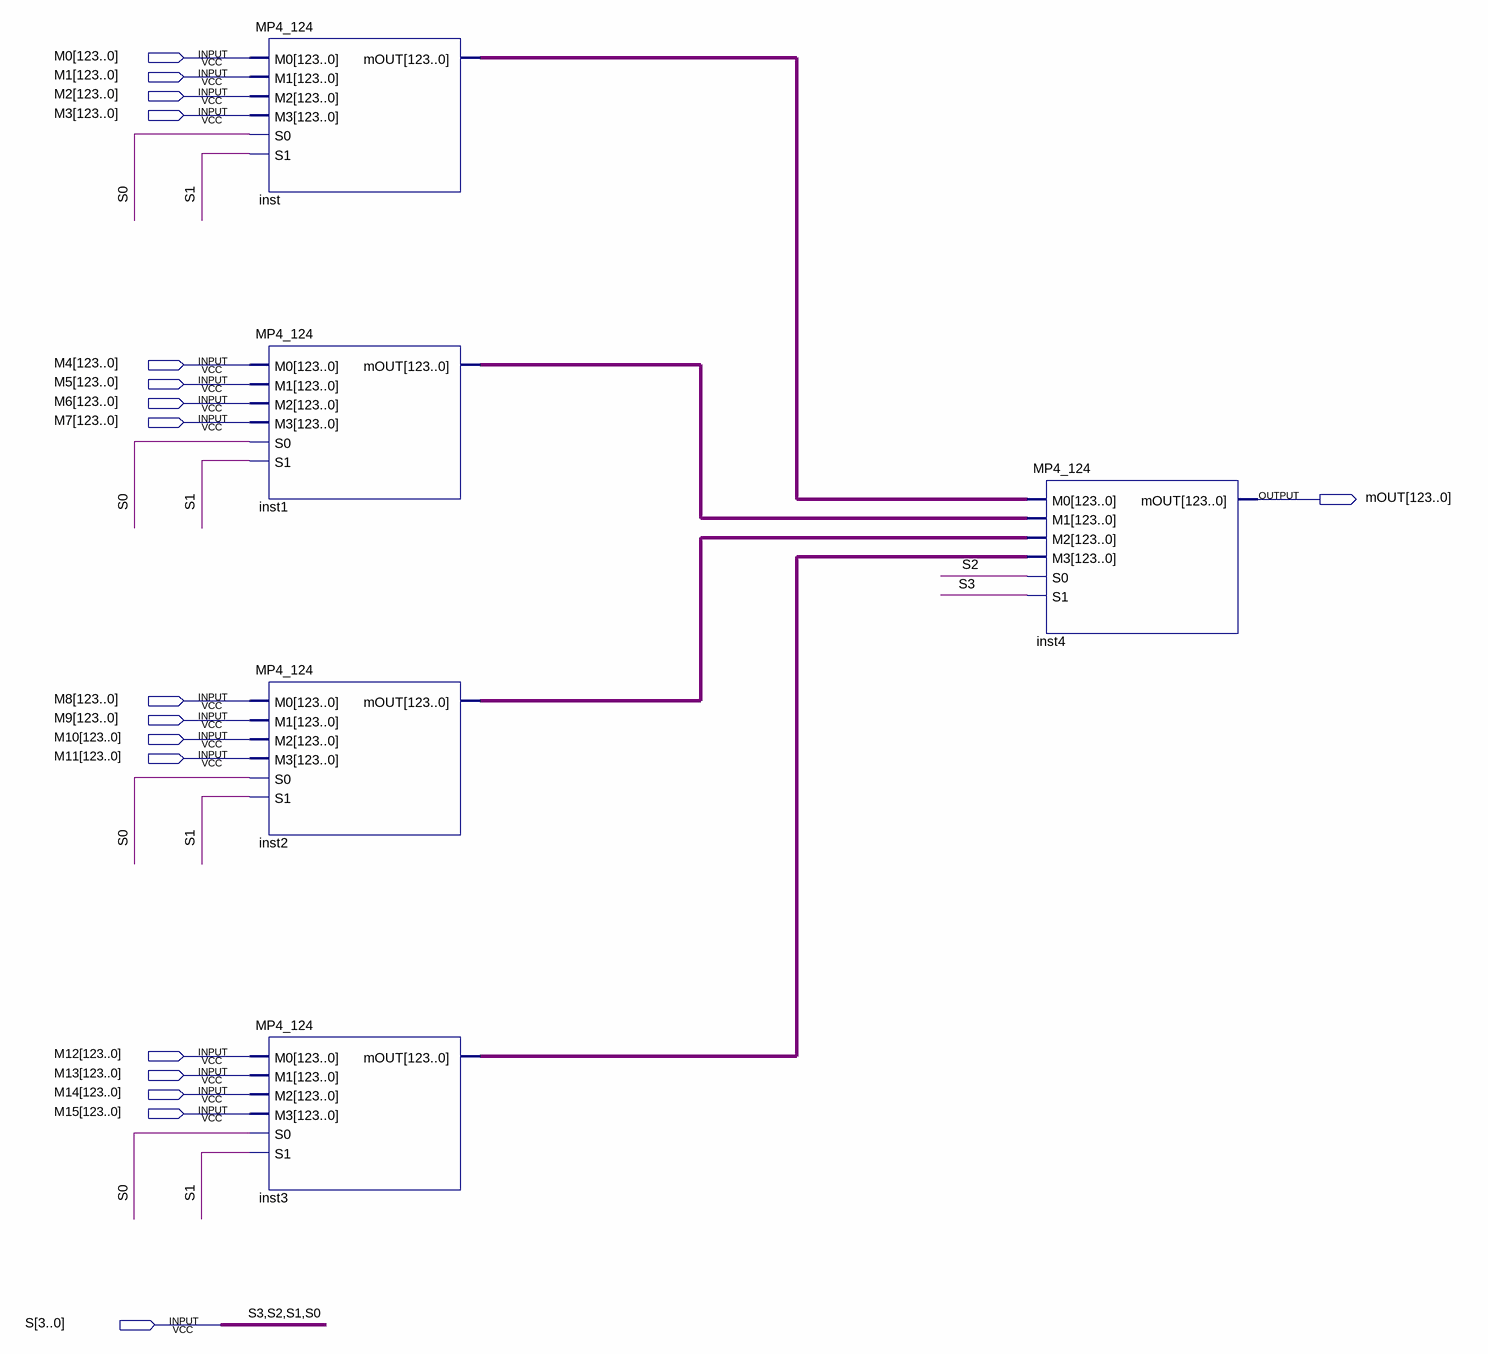
[diagram p0: schematic sheet]
// Quartus schematic MP16_124.bdf as structural Verilog: 5 symbols, 18 pins
module MP16_124 (
  input  [123:0] M0,
  input  [123:0] M1,
  input  [123:0] M2,
  input  [123:0] M3,
  input  [123:0] M4,
  input  [123:0] M5,
  input  [123:0] M6,
  input  [123:0] M7,
  input  [123:0] M8,
  input  [123:0] M9,
  input  [123:0] M10,
  input  [123:0] M11,
  input  [123:0] M12,
  input  [123:0] M13,
  input  [123:0] M14,
  input  [123:0] M15,
  input  [3:0] S,
  output [123:0] mOUT
);

  wire [123:0] inst1_mout, inst2_mout, inst3_mout, inst_mout;

  MP4_124 inst (.M0(M0), .M1(M1), .M2(M2), .M3(M3), .S0(S[0]), .S1(S[1]), .mOUT(inst_mout));
  MP4_124 inst1 (.M0(M4), .M1(M5), .M2(M6), .M3(M7), .S0(S[0]), .S1(S[1]), .mOUT(inst1_mout));
  MP4_124 inst2 (.M0(M8), .M1(M9), .M2(M10), .M3(M11), .S0(S[0]), .S1(S[1]), .mOUT(inst2_mout));
  MP4_124 inst3 (.M0(M12), .M1(M13), .M2(M14), .M3(M15), .S0(S[0]), .S1(S[1]), .mOUT(inst3_mout));
  MP4_124 inst4 (.M0(inst_mout), .M1(inst1_mout), .M2(inst2_mout), .M3(inst3_mout), .S0(S[2]), .S1(S[3]), .mOUT(mOUT));
endmodule
